# EAGLE design Ariel v6.2 (EAGLE 9.3.0)
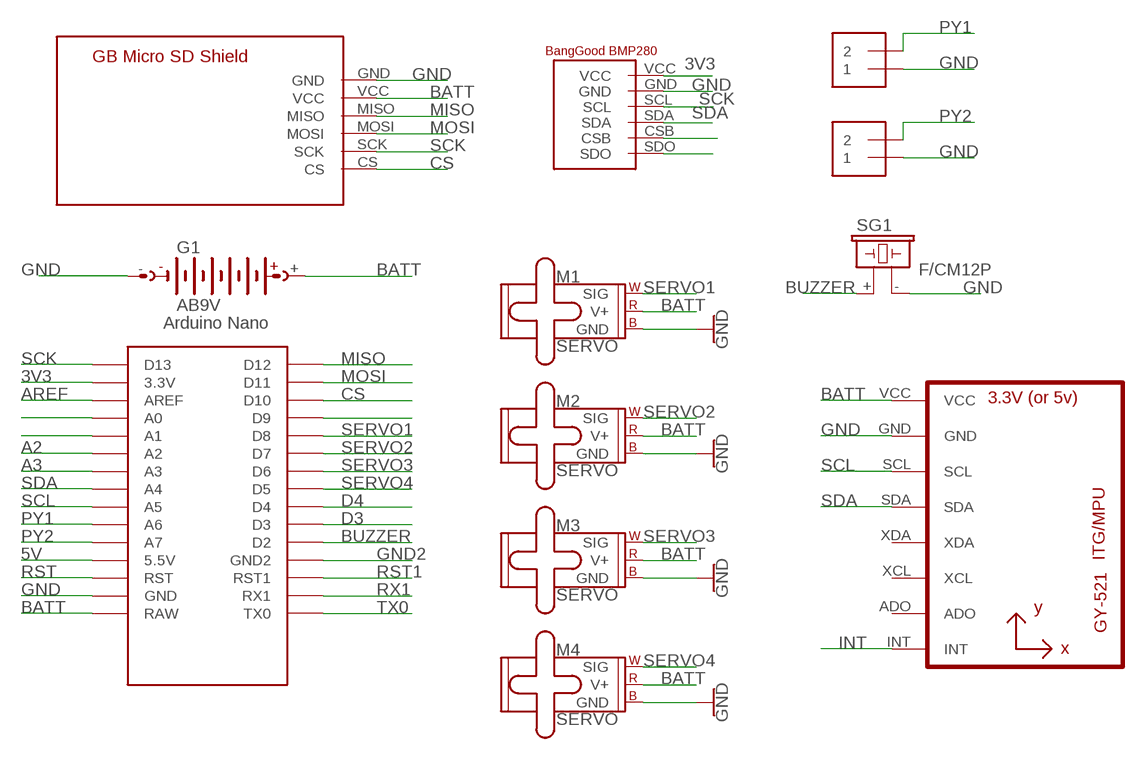
[diagram p0: schematic, sheet 1]

## Parts
G1  AB9V  [AB9V]
J1  1X2-3.5MM  [1X2-3.5MM]
J2  1X2-3.5MM  [1X2-3.5MM]
M1  SERVO  [1X03]
M2  SERVO  [1X03]
M3  SERVO  [1X03]
M4  SERVO  [1X03]
SG1  F/CM12P  [F/CM12P]
U1  GY-521MPU6050  [GY-521]
U$1  NANO  [NANO]
U$2  BG_BMP280  [01BG_BMP280]
U$3  GBMICROSDSHIELD  [GBMICROSDSHIELD]

## Nets
3V3: U$1.3.3V U$2.VCC
5V: U$1.5V(5.5V)
A2: U$1.A2
A3: U$1.A3
AREF: U$1.AREF
BATT: G1.+ M1.2(V+) M2.2(V+) M3.2(V+) M4.2(V+) U1.VCC U$1.RAW U$3.VCC
BUZZER: SG1.+ U$1.D2
CS: U$1.D10 U$3.CS
D3: U$1.D3
D4: U$1.D4
GND: G1.- J1.1 J2.1 M1.3(GND) M2.3(GND) M3.3(GND) M4.3(GND) SG1.- U1.GND U$1.GND U$2.GND U$3.GND
GND2: U$1.GND1(GND2)
INT: U1.INT
MISO: U$1.D12 U$3.MISO
MOSI: U$1.D11 U$3.MOSI
N$1: U$1.A1
N$3: U$1.D9
N$7: U$1.A0
N$8: U$2.CSB
N$9: U$2.SDO
PY1: J1.2 U$1.A6
PY2: J2.2 U$1.A7
RST: U$1.RST
RST1: U$1.RST1
RX1: U$1.RX1
SCK: U$1.D13 U$2.SCL U$3.SCK
SCL: U1.SCL U$1.A5
SDA: U1.SDA U$1.A4 U$2.SDA
SERVO1: M1.1(SIG) U$1.D8
SERVO2: M2.1(SIG) U$1.D7
SERVO3: M3.1(SIG) U$1.D6
SERVO4: M4.1(SIG) U$1.D5
TX0: U$1.TX0
Unconnected: U1.ADO U1.XCL U1.XDA U$1.ICSP1 U$1.ICSP2 U$1.ICSP3 U$1.ICSP4 U$1.ICSP5 U$1.ICSP6

## Library data of the parts
G1 = battery:AB9V: 9-V BATTERY CLIP
J1 J2 = adafruit:1X2: 3.5mm Terminal block http://www.ladyada.net/library/pcb/eaglelibrary.html
M1-M4 = SparkFun-Electromechanical:SERVO: Servo Motor 3-pin connector for a standard servo motor (voltage supply, ground, and control signal.) SparkFun Products Servo - Generic (Sub-Micro Size) <https://www.sparkfun.com/products/9065> (ROB-09065) Servo - Generic High Torque Continuous Rotation (Standard Size) <https://www.sparkfun.com/products/9347> (ROB-09347) Servo - Generic High Torque (Standard Size) <https://www.sparkfun.com/products/11965> (ROB-11965)
SG1 = buzzer:F/CM12P: BUZZER Source: Buerklin; OC_FARNELL: unknown; OC_NEWARK: unknown
U1 = gy-521:GY-521
U$1 = Arduino-clone:NANO: Arduino Nano
U$2 = BG_BMP280:BG_BMP280: BMP280 Pressure sensor/altimeter ordered from banggood.com, 15.6mmx11.6mm, 6 pin, pins spaced at 1.3 mm footprint, symbol pins spaced @ 2.22857mm
U$3 = GB Micro SD Card Shield:GBMICROSDSHIELD

## Net classes
0 default: width 0.75 mm, clearance 0.35 mm

## Board
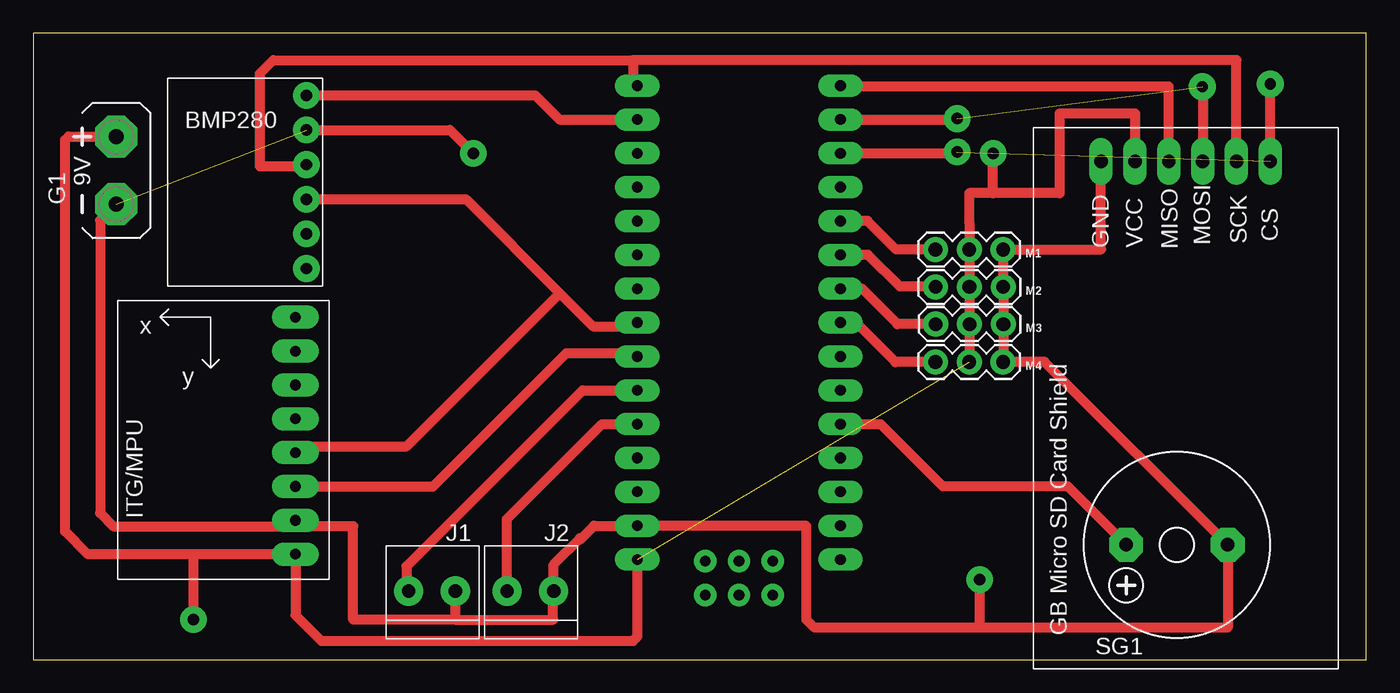
[diagram p1: board, top side]

Size 100 x 47 mm. Coordinates in mm from the lower left corner, seen from the top.
Outline: 0,0 100,0 100,47 0,47 0,0
Copper layers (1*16): Top 0.035mm / dielectric 1.5mm / Bottom 0.035mm
Design rules "default": minimum track width 6mil, minimum drill 0.35mm, track to track 6mil, track to pad 6mil, pad to pad 6mil, via to via 6mil, smd to smd 6mil, copper to edge 40mil, drill to drill 6mil, minimum pad ring 10mil, minimum via ring 8mil, stop-mask expansion 4mil, vias tented up to drill 0mil, thermal gap 10mil

### Footprints (pad centres in the part's own frame; a part is rotated, then mirrored left to right if it is on the bottom)
AB9V = drill 1.118 pad 3.15 octagon: + 0,2.54; - 0,-2.54
1X2-3.5MM = drill 1 pad 2.184: 1 1.8,0; 2 -1.7,0
1X03 = drill 1.016 pad 1.88: 1 0,0; 2 2.54,0; 3 5.08,0
F/CM12P = drill 1.016 pad 2.54 octagon: + 3.81,0; - -3.81,0
GY-521 = drill 0.8 pad 1.778 long: ADO -8.89,-6.35; GND -8.89,6.35; INT -8.89,-8.89; SCL -8.89,3.81; SDA -8.89,1.27; VCC -8.89,8.89; XCL -8.89,-3.81; XDA -8.89,-1.27
NANO = drill 0.8 pad 1.676 long: 3.3V -10.16,24.13; 5V -10.16,-1.27; A0 -10.16,19.05; A1 -10.16,16.51; A2 -10.16,13.97; A3 -10.16,11.43; A4 -10.16,8.89; A5 -10.16,6.35; A6 -10.16,3.81; A7 -10.16,1.27; AREF -10.16,21.59; D2 5.08,1.27; D3 5.08,3.81; D4 5.08,6.35; D5 5.08,8.89; D6 5.08,11.43; D7 5.08,13.97; D8 5.08,16.51; D9 5.08,19.05; D10 5.08,21.59; D11 5.08,24.13; D12 5.08,26.67; D13 -10.16,26.67; GND -10.16,-6.35; GND1 5.08,-1.27; RAW -10.16,-8.89; RST -10.16,-3.81; RST1 5.08,-3.81; RX1 5.08,-6.35; TX0 5.08,-8.89 | drill 0.8 pad 1.676: ICSP1 -5.08,-11.557; ICSP2 -5.08,-9.017; ICSP3 -2.54,-11.557; ICSP4 -2.54,-9.017; ICSP5 0,-11.557; ICSP6 0,-9.017
01BG_BMP280 = drill 0.85 pad 2: CSB 10.4,3.9; GND 10.4,11.7; SCL 10.4,9.1; SDA 10.4,6.5; SDO 10.4,1.3; VCC 10.4,14.3
GBMICROSDSHIELD = drill 1 pad 1.778 long: CS 38.1,5.08; GND 38.1,17.78; MISO 38.1,12.7; MOSI 38.1,10.16; SCK 38.1,7.62; VCC 38.1,15.24

### Placement (x,y rotation side)
G1  6.22,36.71 0 top
J1  29.86,5.14 0 top
J2  37.24,5.14 0 top
M1  67.68,30.77 0 top
M2  67.69,27.97 0 top
M3  67.7,25.17 0 top
M4  67.68,22.33 0 top
SG1  85.8,8.61 180 top
U1  10.78,16.8 180 top
U$1  55.48,16.4 0 top
U$2  10.09,28.04 0 top
U$3  97.89,-0.71 90 top

### Tracks (layer width: path | path; a pad name or v marks a point on that pad's centre or on a via)
3V3
  Top 0.75: U$2.VCC 37.66,42.34 39.47,40.53 U$1.3.3V
BATT  (via drill 0.85 pad 2)  (1 unrouted)
  Top 0.75: M4.2 70.24,22.35 M3.2 M2.2 M1.2 70.22,32.78 70.2,32.8 70.2,35 72,35 | U$1.RAW 45.32,1.71 45,1.39 21.61,1.39 19.67,3.33 U1.VCC 12,7.91 | 12,7.91 4.09,7.91 2.39,9.61 2.39,39 2.64,39.25 G1.+ | 72,35 77,35 77,41 82.65,41 U$3.VCC | 12,7.91 v12,3 | 72,35 v72,38
BUZZER
  Top 0.75: SG1.+ 77.6,13 68.23,13 63.56,17.67 U$1.D2
CS  (via drill 0.85 pad 2)  (1 unrouted)
  Top 0.75: U$3.CS v92.81,43.19 v92.8,43.2 | U$1.D10 69.19,37.99 v69.3,38.1
GND  (via drill 0.85 pad 2)  (1 unrouted)
  Top 0.75: 72.78,22.35 M3.3 M2.3 M1.3 80.11,30.77 U$3.GND | 72.78,22.35 M4.3 | J1.1 31.66,3 | 31.66,3 39,3 39,5.1 J2.1 39.04,7.14 41,9.1 41,9 42.05,10.05 U$1.GND 57.95,10.05 58,10 58,3 58.61,2.39 71,2.39 | 72.78,22.35 75.87,22.35 SG1.- 89.61,2.39 71,2.39 | 31.66,3 24,3 24,10 20.12,10 | 20.12,10 U1.GND | G1.- 5,32.95 5,11 6,10 20.12,10 | U$2.GND 31.26,39.74 v33,38 | 71,2.39 v71,6
MISO
  Top 0.75: U$3.MISO 85.19,43 60.49,43 | 60,43 60.49,43 | 60.49,43 U$1.D12
MOSI  (via drill 0.85 pad 2)  (1 unrouted)
  Top 0.75: v87.7,43 87.73,43 U$3.MOSI | U$1.D11 69.23,40.53 v69.3,40.6
PY1
  Top 0.75: J1.2 28,5.3 28,7 41.21,20.21 U$1.A6
PY2
  Top 0.75: J2.2 35.54,10.54 42.67,17.67 U$1.A7
SCK
  Top 0.75: U$2.SCL 20.35,37 17,37 17,44 18,45 45,45 | 45,45 45,43.39 U$1.D13 | 89.8,37.86 U$3.SCK 90.27,45 45,45
SCL
  Top 0.75: U1.SCL 29.99,12.99 40,23 45.07,23 U$1.A5
SDA
  Top 0.75: U$2.SDA 32.46,34.54 39.55,27.45 | 39.55,27.45 42,25 45.03,25 U$1.A4 | U1.SDA 20.14,16 28,16 39.45,27.45 39.55,27.45
SERVO1
  Top 0.75: M1.1 64.73,30.77 62.59,32.91 U$1.D8
SERVO2
  Top 0.75: M2.1 67.66,28 65,28 62.63,30.37 U$1.D7
SERVO3
  Top 0.75: M3.1 64.83,25.17 62.17,27.83 U$1.D6
SERVO4
  Top 0.75: M4.1 64.67,22.33 61.71,25.29 U$1.D5